# EAGLE design Wire Finder (EAGLE 7.6.0)
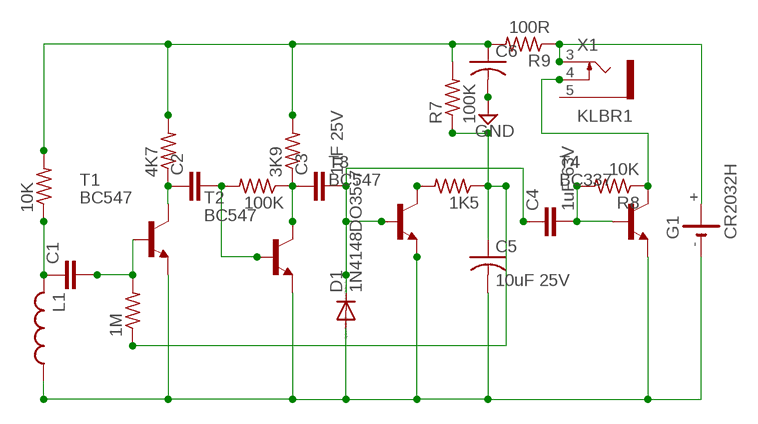
[diagram p0: schematic, sheet 1]

## Parts
1K5  R-US_0204/7  [0204/7]
1M  R-US_0204/7  [0204/7]
3K9  R-US_0204/7  [0204/7]
4K7  R-US_0204/7  [0204/7]
10K  R-US_0204/7  [0204/7]
100K  R-US_0204/7  [0204/7]
C1  C2.5/2  [C2.5-2]
C2  C2.5/2  [C2.5-2]
C3  1uF 25V  C2.5/2  [C2.5-2]
C4  1uF 63V  C2.5/2  [C2.5-2]
C5  10uF 25V  C-US025-024X044  [C025-024X044]
C6  C-US025-024X044  [C025-024X044]
D1  1N4148DO35-7  [DO35-7]
G1  CR2032H  [CR2032H]
L1  L-USIR-2  [IR-2]
R7  100K  R-US_0204/7  [0204/7]
R8  10K  R-US_0204/7  [0204/7]
R9  100R  R-US_0204/7  [0204/7]
T1  BC547  [TO92]
T2  BC547  [TO92]
T3  BC547  [TO92]
T4  BC337  [TO92]
X1  KLBR1  [KLBR1]

## Nets
GND: C6.2
N$1: 4K7.1 C2.1 T1.3(C)
N$2: 3K9.1 100K.1 C3.1 T2.3(C)
N$3: C3.2 C4.1 D1.C T3.2(B)
N$4: R8.1 T4.3(C) X1.4
N$5: 10K.1 C1.1 L1.2
N$6: 100K.2 C2.2 T2.2(B)
N$8: 1M.2 C1.2 T1.2(B)
N$9: 1K5.1 1M.1 C5.1 R7.1
N$10: G1.+ G1.+@1(+) R9.1 X1.3
N$12: 1K5.2 T3.3(C)
N$13: C4.2 R8.2 T4.2(B)
N$14: C5.2 D1.A G1.- L1.1 T1.1(E) T2.1(E) T3.1(E) T4.1(E)
N$15: 3K9.2 4K7.2 10K.2 C6.1 R7.2 R9.2
Unconnected: X1.5

## Library data of the parts
1K5 1M 3K9 4K7 10K 100K R7-R9 = resistor:R-US_: RESISTOR, American symbol
C1-C4 = capacitor-wima:C: CAPACITOR naming: grid - package width
C5 C6 = adafruit:C-US: CAPACITOR, American symbol
D1 = diode:1N4148: DIODE high speed (Philips)
G1 = battery:CR2032H: LI BATTERY Varta
L1 = rcl:L-US: INDUCTOR, American symbol
T1-T3 = transistor:BC547: NPN TRANSISTOR
T4 = transistor:BC337: NPN TRANSISTOR
X1 = con-lumberg:KLBR?: Jack connectors according to JISC 6560, 2.5mm / 3.5 mm Klinkensteckverbinder nach JISC 6560, 2.5mm / 3,5 mm Source: http://www.lumberg.com/Produkte/PDFs/KLBR2.pdf www.lumberg.com/Produkte/PDFs/KLBR1.pdf; MPN: KLBR 1; OC_FARNELL: 1200140; OC_NEWARK: 97K2707

## Board
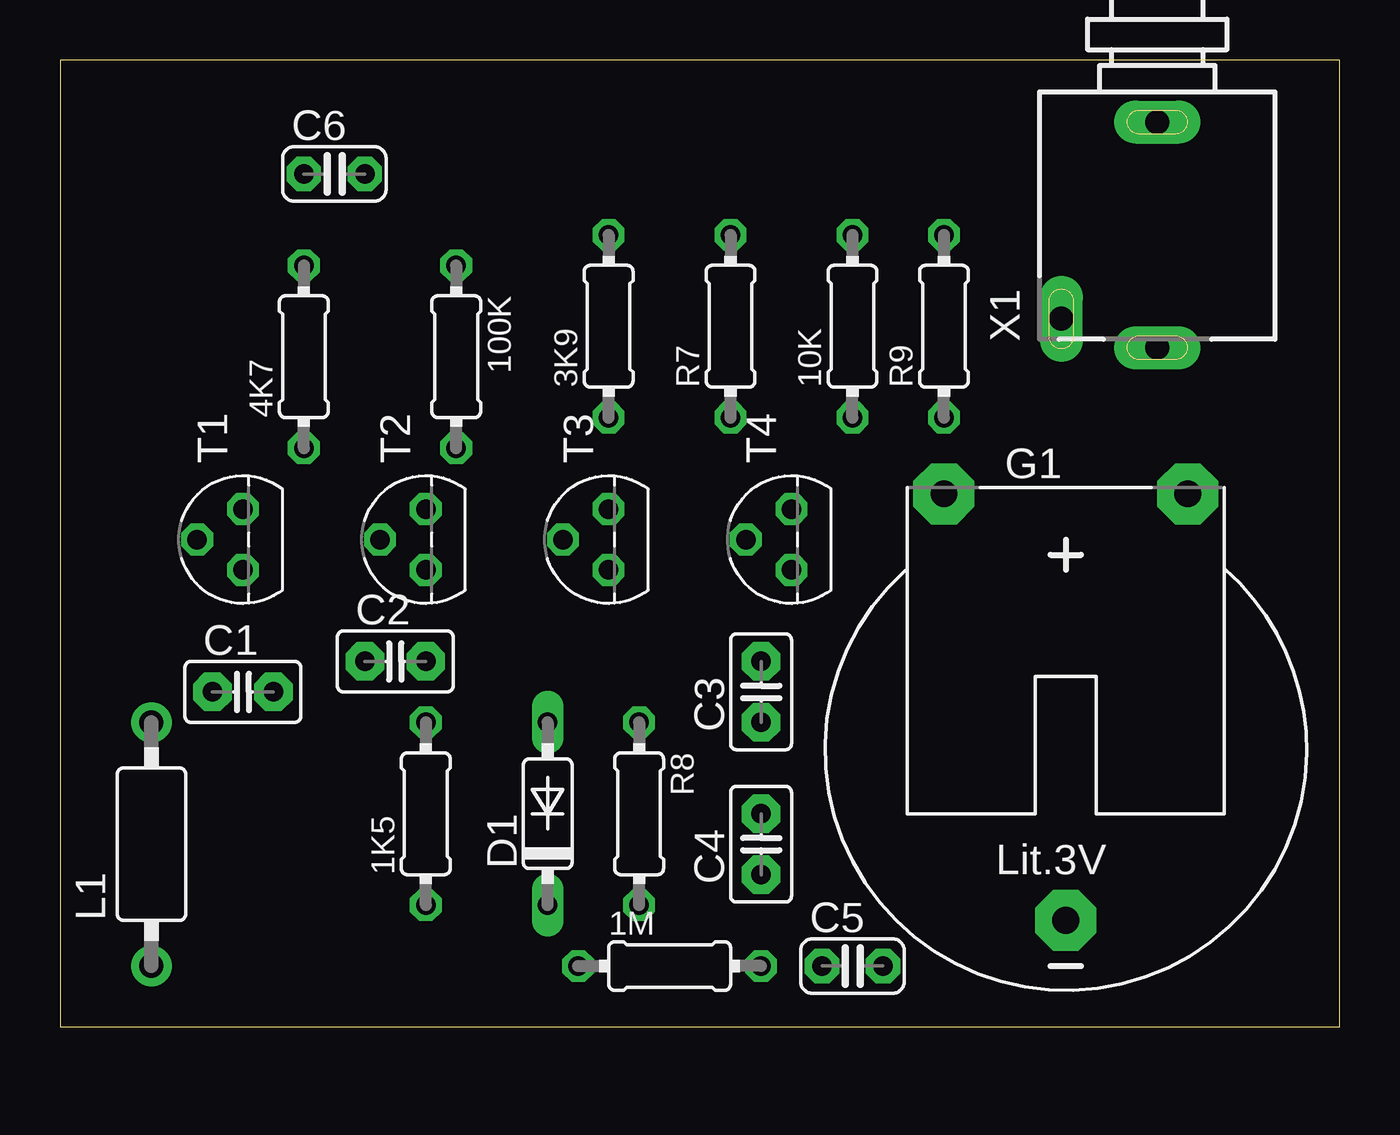
[diagram p1: board, top side]
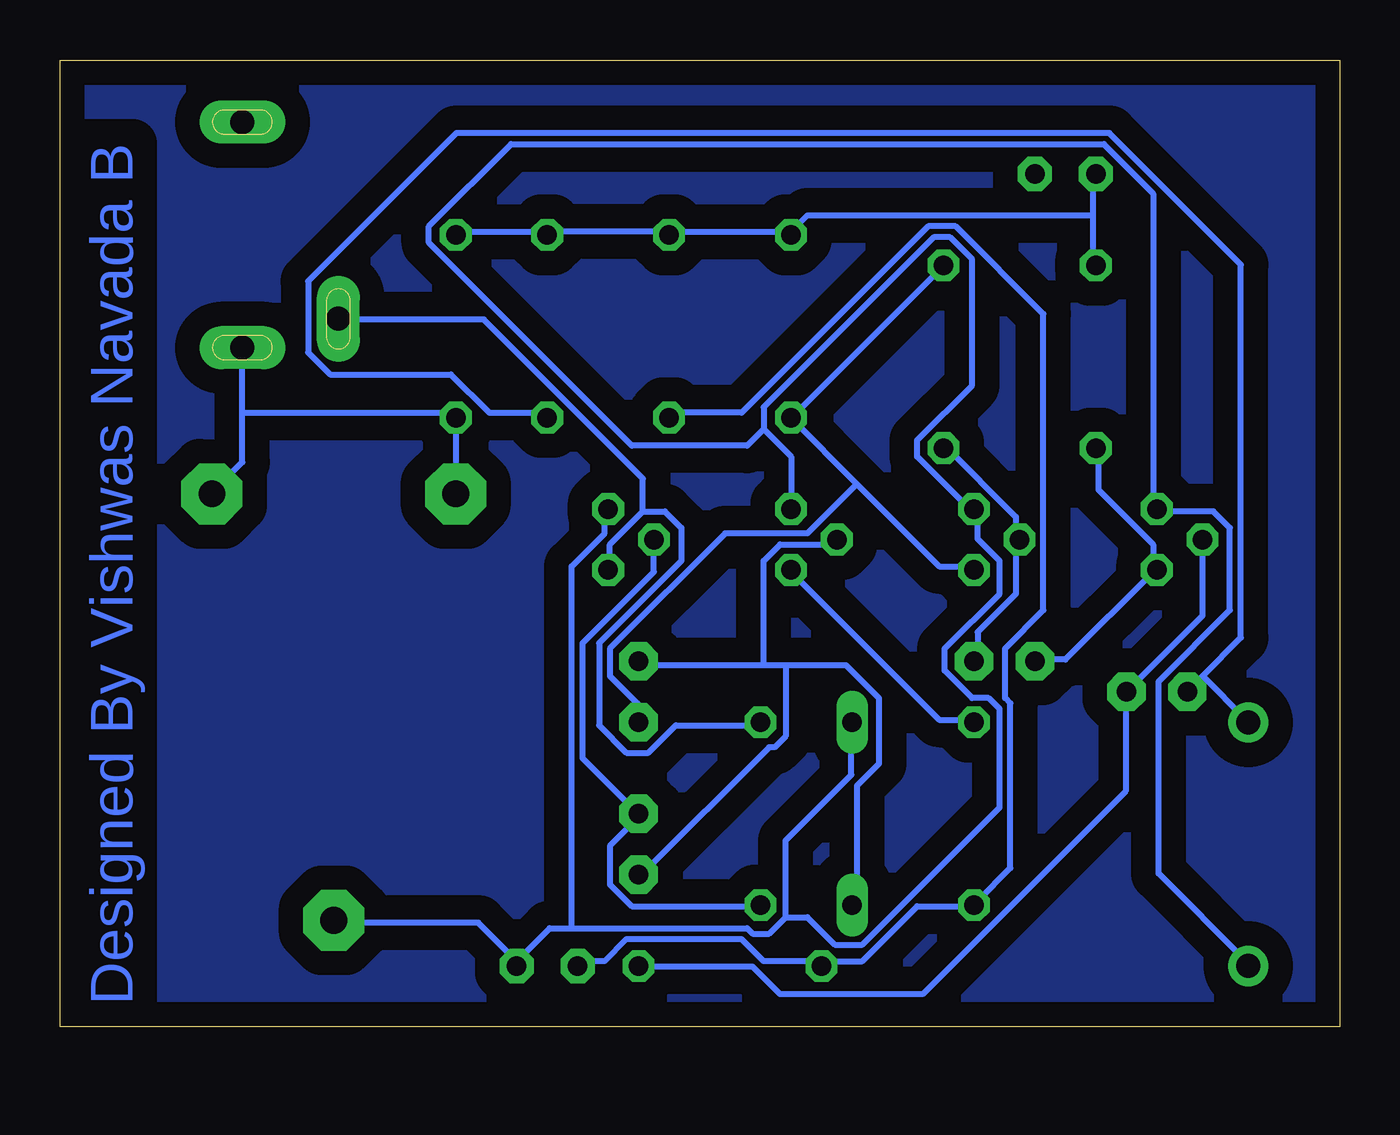
[diagram p2: board, bottom side, seen from below]

Size 53.32 x 40.31 mm. Coordinates in mm from the lower left corner, seen from the top.
Outline: 0,0 53.32,0 53.32,40.31 0,40.31 0,0
Copper layers (1*16): Top 0.035mm / dielectric 1.5mm / Bottom 0.035mm
Design rules "default": minimum track width 10mil, minimum drill 24mil, track to track 8mil, track to pad 8mil, pad to pad 8mil, via to via 8mil, smd to smd 8mil, copper to edge 40mil, drill to drill 8mil, minimum pad ring 10mil, minimum via ring 8mil, stop-mask expansion 4mil, vias tented up to drill 0mil, thermal gap 10mil

### Footprints (pad centres in the part's own frame; a part is rotated, then mirrored left to right if it is on the bottom)
0204/7 = drill 0.813 octagon: 1 -3.81,0; 2 3.81,0
C2.5-2 = drill 0.813 pad 1.6 octagon: 1 -1.27,0; 2 1.27,0
C025-024X044 = drill 0.813 pad 1.422 octagon: 1 -1.27,0; 2 1.27,0
DO35-7 = drill 0.813 long: A 3.81,0; C -3.81,0
CR2032H = drill 1.118 pad 2.54 octagon: + 5.08,10.795; +@1 -5.08,10.795; - 0,-6.985
IR-2 = drill 1 pad 1.676: 1 -5.08,0; 2 5.08,0
TO92 = drill 0.813 octagon: 1 1.27,0; 2 0,1.905; 3 -1.27,0
KLBR1 = drill 1 pad 1.8 long: 3 0,-4.7; 4 -4,-3.5; 5 0,4.7

### Placement (x,y rotation side)
1K5  15.24,8.89 90 top
1M  25.4,2.54 0 top
3K9  22.86,29.21 90 top
4K7  10.16,27.94 90 top
10K  33.02,29.21 90 top
100K  16.51,27.94 270 top
C1  7.62,13.97 0 top
C2  13.97,15.24 0 top
C3  29.21,13.97 90 top
C4  29.21,7.62 90 top
C5  33.02,2.54 0 top
C6  11.43,35.56 0 top
D1  20.32,8.89 90 top
G1  41.91,11.43 0 top
L1  3.81,7.62 90 top
R7  27.94,29.21 90 top
R8  24.13,8.89 270 top
R9  36.83,29.21 90 top
T1  7.62,20.32 90 top
T2  15.24,20.32 90 top
T3  22.86,20.32 90 top
T4  30.48,20.32 90 top
X1  45.72,33.02 0 top

### Tracks (layer width: path | path; a pad name or v marks a point on that pad's centre or on a via)
N$1
  Bottom 0.254: 12.8,15.32 C2.1 12.57,15.32 11.43,15.32 7.77,18.97 T1.3 7.77,19.2 7.77,20.12 10.06,22.4 10.06,24 4K7.1
N$2
  Bottom 0.254: 16.69,31.77 100K.1 16.69,31.55 22.86,25.38 | 22.86,25.38 20.12,22.63 | 20.12,22.63 16.69,19.2 15.32,19.2 T2.3 | 22.86,25.38 3K9.1 | 20.12,22.63 22.17,20.57 25.6,20.57 30.4,15.77 30.4,14.63 29.26,13.49 29.26,12.8 C3.1
N$3
  Bottom 0.254: 24,15.09 29.03,15.09 C3.2 | 24,15.09 23.09,15.09 | 23.09,15.09 20.57,15.09 19.2,13.72 19.2,10.97 20.12,10.06 20.12,5.26 D1.C | 24,15.09 24,19.43 23.32,20.12 21.03,20.12 T3.2 | 23.09,15.09 23.09,12.12 23.55,11.66 23.77,11.66 29.03,6.4 C4.1
N$4
  Bottom 0.254: 29.03,21.49 28.12,21.49 27.43,20.8 27.43,19.43 30.86,16 30.86,12.57 29.72,11.43 28.8,11.43 27.66,12.57 24.23,12.57 R8.1 | 29.03,21.49 30.4,20.12 30.4,19.2 T4.3 | 29.03,21.49 29.03,22.86 35.66,29.49 41.6,29.49 X1.4
N$5
  Bottom 0.254: 5.71,14.63 6.17,14.17 C1.1 | 5.71,14.63 4.12,16.23 4.12,31.77 9.6,37.26 36.8,37.26 42.98,31.09 42.98,28.12 42.06,27.2 37.03,27.2 35.43,25.6 33.15,25.6 10K.1 | 5.71,14.63 3.89,12.8 L1.2
N$6
  Bottom 0.254: 100K.2 16.46,24.23 13.49,21.26 13.49,20.34 T2.2 13.49,20.12 13.49,18.06 15.09,16.46 15.09,15.32 C2.2
N$7
  pour Bottom (isolate 1.016): 0,40.64 53.34,40.64 53.34,0 0,0
N$8
  Bottom 0.254: T1.2 5.71,17.14 C1.2 8.91,13.95 8.91,9.83 17.37,1.37 23.32,1.37 24.46,2.52 29.03,2.52 1M.2
N$9
  Bottom 0.254: R7.1 27.89,25.6 24.92,25.6 17.14,33.38 16,33.38 12.34,29.72 12.34,17.37 13.95,15.77 13.95,13.72 13.72,13.49 13.72,6.63 15.09,5.26 1K5.1 15.32,5.03 17.6,5.03 19.89,2.74 21.49,2.74 1M.1 21.72,2.74 24,2.74 24.92,3.66 29.72,3.66 30.63,2.74 31.55,2.74 C5.1
N$10
  Bottom 0.254: G1.+@1 36.8,22.4 36.8,25.38 R9.1 37.03,25.6 45.72,25.6 | 45.72,25.6 45.72,23.55 46.86,22.4 G1.+ | 45.72,25.6 X1.3
N$12
  Bottom 0.254: 1K5.2 15.32,12.8 16.69,12.8 22.86,18.97 T3.3
N$13
  Bottom 0.254: R8.2 24.23,5.03 29.49,5.03 30.4,5.94 30.4,7.54 29.26,8.69 C4.2 29.26,8.91 31.55,11.2 31.55,16 28.57,18.97 T4.2
N$14
  Bottom 0.254: L1.1 3.89,2.74 7.54,6.4 7.54,14.4 4.57,17.37 4.57,20.8 5.26,21.49 7.54,21.49 T1.1 7.77,21.72 7.77,34.75 9.83,36.8 34.52,36.8 37.95,33.38 37.95,32.69 29.49,24.23 24.69,24.23 24,24.92 | 23.09,4.57 23.09,7.77 20.34,10.52 20.34,12.57 D1.A | 23.09,4.57 23.77,3.89 24.46,3.89 24.69,4.12 32,4.12 | 32,4.12 32.92,4.12 34.29,2.74 | 23.09,4.57 22.17,4.57 21.03,3.43 19.89,3.43 14.17,9.14 14.17,13.26 14.63,13.72 15.32,13.72 16.46,14.86 16.46,15.77 14.17,18.06 14.17,19.43 15.09,20.34 15.09,21.49 T2.1 15.32,21.49 17.6,23.77 17.6,24.46 15.32,26.75 15.32,32 16.23,32.92 16.92,32.92 24,25.83 24,24.92 | T3.1 22.86,23.77 24,24.92 | 32,4.12 32,19.2 30.63,20.57 30.63,21.49 T4.1 | 34.29,2.74 35.89,4.34 41.83,4.34 G1.- | 34.29,2.74 C5.2
N$15
  Bottom 0.254: 10.29,33.83 10.29,35.43 C6.1 | 10.29,33.83 10.29,31.77 4K7.2 | R9.2 36.8,33.15 33.15,33.15 10K.2 32.92,33.15 28.12,33.15 R7.2 27.89,33.15 22.86,33.15 | 10.29,33.83 22.17,33.83 22.86,33.15 | 22.86,33.15 3K9.2

### Text on the board
Bottom: Designed By Vishwas Navada B